# Altium project TPcape_breakout.PrjPcb
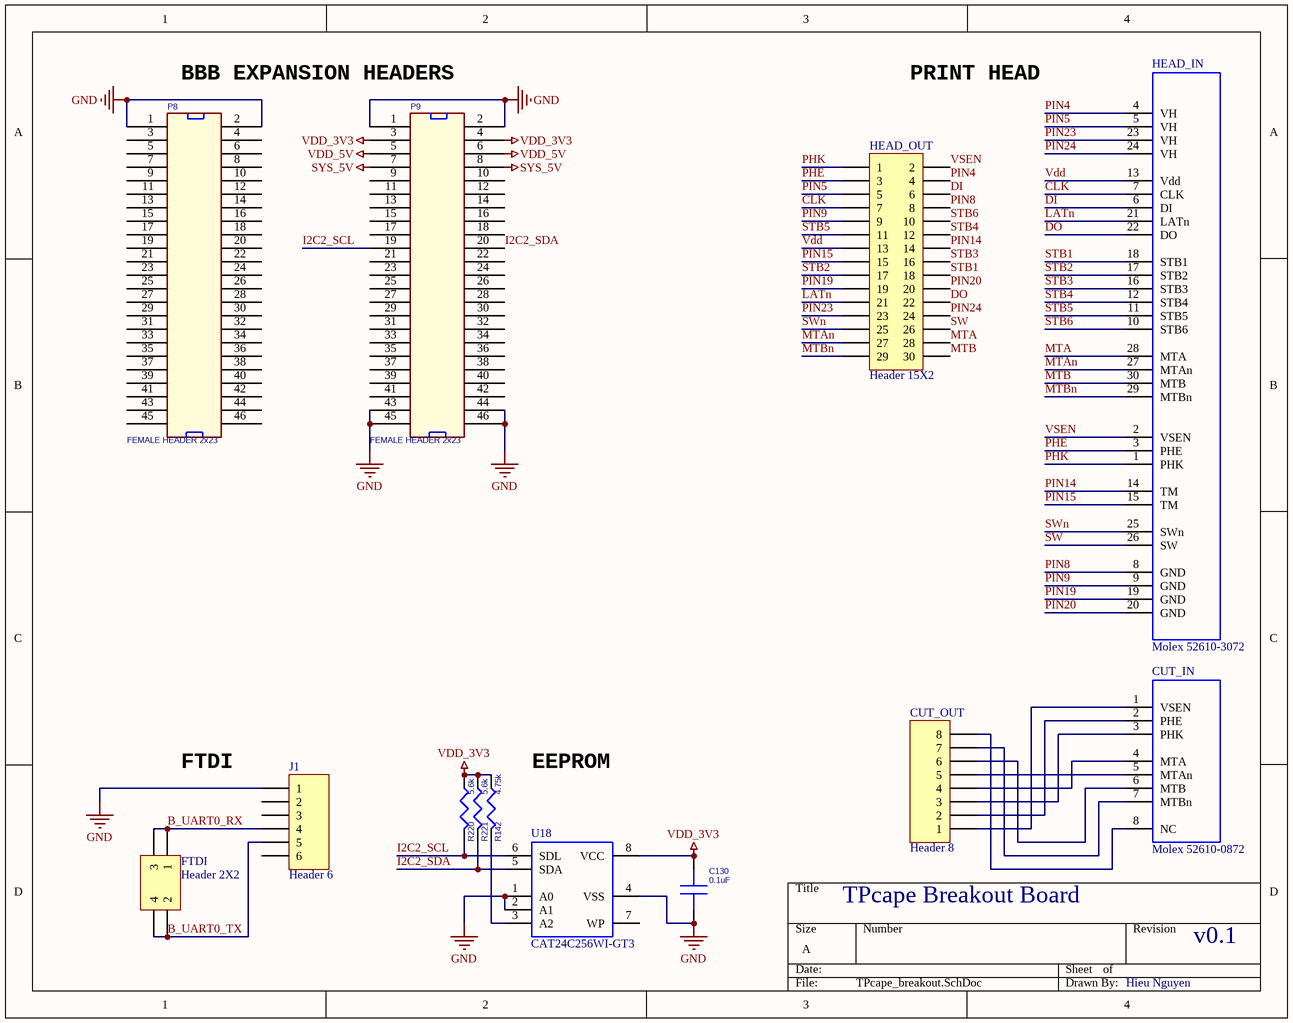
[diagram p0: TPcape_breakout.SchDoc]
1 sheet, 13 parts. Net scope: global (net labels, ports and power ports of the same name join across sheets).
Board file: TPcape_breakout.PcbDoc

## Sheet TPcape_breakout.SchDoc
size A

### Parts
C130  0.1uF  [402]
CUT_IN  Molex 52610-0872  [Molex 52610-0872]
CUT_OUT  Header 8  [HDR1X8]
FTDI  Header 2X2  [SSM-102-S-DV]
HEAD_IN  Molex 52610-3072  [Molex 52610-3072]
HEAD_OUT  Header 15X2  [HDR2X15]
J1  Header 6  [HDR1X6]
P8  FEMALE HEADER 2x23  [HDR2X23]
P9  FEMALE HEADER 2x23  [HDR2X23]
R142  4.75k  [402]
R220  5.6k  [402]
R221  5.6k  [402]
U18  CAT24C256WI-GT3  [CAT24C256WI-GT3]

### Nets
GND: C130.2 J1.1 P8.1 P8.2 P9.1 P9.2 P9.43 P9.44 P9.45 P9.46 U18.1(A0) U18.2(A1) U18.4(VSS)
SYS_5V: P9.7 P9.8
VDD_3V3: C130.1 P9.3 P9.4 R142.2(P2) R220.2(P2) R221.2(P2) U18.8(VCC)
VDD_5V: P9.5 P9.6
B_UART0_RX: FTDI.1 FTDI.3 J1.4
B_UART0_TX: FTDI.2 FTDI.4 J1.5
CLK: HEAD_IN.7(CLK) HEAD_OUT.7
DI: HEAD_IN.6(DI) HEAD_OUT.6
DO: HEAD_IN.22(DO) HEAD_OUT.22
I2C2_SCL: P9.19 R220.1(P1) U18.6(SDL)
I2C2_SDA: P9.20 R221.1(P1) U18.5(SDA)
LATn: HEAD_IN.21(LATn) HEAD_OUT.21
MTA: HEAD_IN.28(MTA) HEAD_OUT.28
MTAn: HEAD_IN.27(MTAn) HEAD_OUT.27
MTB: HEAD_IN.30(MTB) HEAD_OUT.30
MTBn: HEAD_IN.29(MTBn) HEAD_OUT.29
PHE: HEAD_IN.3(PHE) HEAD_OUT.3
PHK: HEAD_IN.1(PHK) HEAD_OUT.1
PIN4: HEAD_IN.4(VH) HEAD_OUT.4
PIN5: HEAD_IN.5(VH) HEAD_OUT.5
PIN8: HEAD_IN.8(GND) HEAD_OUT.8
PIN9: HEAD_IN.9(GND) HEAD_OUT.9
PIN14: HEAD_IN.14(TM) HEAD_OUT.14
PIN15: HEAD_IN.15(TM) HEAD_OUT.15
PIN19: HEAD_IN.19(GND) HEAD_OUT.19
PIN20: HEAD_IN.20(GND) HEAD_OUT.20
PIN23: HEAD_IN.23(VH) HEAD_OUT.23
PIN24: HEAD_IN.24(VH) HEAD_OUT.24
STB1: HEAD_IN.18(STB1) HEAD_OUT.18
STB2: HEAD_IN.17(STB2) HEAD_OUT.17
STB3: HEAD_IN.16(STB3) HEAD_OUT.16
STB4: HEAD_IN.12(STB4) HEAD_OUT.12
STB5: HEAD_IN.11(STB5) HEAD_OUT.11
STB6: HEAD_IN.10(STB6) HEAD_OUT.10
SW: HEAD_IN.26(SW) HEAD_OUT.26
SWn: HEAD_IN.25(SWn) HEAD_OUT.25
Vdd: HEAD_IN.13(Vdd) HEAD_OUT.13
VSEN: HEAD_IN.2(VSEN) HEAD_OUT.2
NetCUT_IN_1: CUT_IN.1(VSEN) CUT_OUT.1
NetCUT_IN_2: CUT_IN.2(PHE) CUT_OUT.2
NetCUT_IN_3: CUT_IN.3(PHK) CUT_OUT.3
NetCUT_IN_4: CUT_IN.4(MTA) CUT_OUT.4
NetCUT_IN_5: CUT_IN.5(MTAn) CUT_OUT.5
NetCUT_IN_6: CUT_IN.6(MTB) CUT_OUT.6
NetCUT_IN_7: CUT_IN.7(MTBn) CUT_OUT.7
NetCUT_IN_8: CUT_IN.8(NC) CUT_OUT.8
NetR142_1: R142.1(P1) U18.3(A2)

Not connected (* = marked no-connect by the designer): J1 2 3 6; P8 3(2) 4(27) 5(3) 6(28) 7(4) 8(29) 9(5) 10(30) 11(6) 12(31) 13(7) 14(32) 15(8) 16(33) 17(9) 18(34) 19(10) 20(35) 21(11) 22(36) 23(12) 24(37) 25(13) 26(38) 27(14) 28(39) 29(15) 30(40) 31(16) 32(41) 33(17) 34(42) 35(18) 36(43) 37(19) 38(44) 39(20) 40(45) 41(21) 42(46) 43(22) 44(47) 45(23) 46(48); P9 9(5) 10(30) 11(6) 12(31) 13(7) 14(32) 15(8) 16(33) 17(9) 18(34) 21(11) 22(36) 23(12) 24(37) 25(13) 26(38) 27(14) 28(39) 29(15) 30(40) 31(16) 32(41) 33(17) 34(42) 35(18) 36(43) 37(19) 38(44) 39(20) 40(45) 41(21) 42(46); U18 7(WP)

### Notes on the sheet
- BBB EXPANSION HEADERS
- PRINT HEAD
- FTDI
- EEPROM
- TPcape Breakout Board
- v0.1
- Hieu Nguyen

### Library data of the parts
C130 = CAP SMD: No Description
CUT_IN = Molex 52610-0872: FPC connector for Fujitsu FTP-628MCL401 (Molex 52610-0871 is obsolete)
CUT_OUT = Header 8: Header, 8-Pin; LatestRevisionDate: 17-Jul-2002; LatestRevisionNote: Re-released for DXP Platform.; Publisher: Altium Limited
FTDI = Header 2X2: Header, 2-Pin, Dual row; LatestRevisionDate: 17-Jul-2002; LatestRevisionNote: Re-released for DXP Platform.; Publisher: Altium Limited
HEAD_IN = Molex 52610-3072: FPC connector for Fujitsu FTP-628MCL401 print head (Molex 52610-3071 is obsolete)
HEAD_OUT = Header 15X2: Header, 15-Pin, Dual row; LatestRevisionDate: 17-Jul-2002; LatestRevisionNote: Re-released for DXP Platform.; Publisher: Altium Limited
J1 = Header 6: Header, 6-Pin; LatestRevisionDate: 17-Jul-2002; LatestRevisionNote: Re-released for DXP Platform.; Publisher: Altium Limited
P8 P9 = HDR_46_F_2_0.1_0.1: CONN HEADER FMAL 46PS.1" DL GOLD; Manufacturer: Sullins Connector Solutions; Manufacturer Part Number: PPPC232LFBN-RC; Number of Positions: 46; Number of Positions Loaded: All; Pitch: 0.100" (2.54mm); Supplier 1: Digi-Key; Supplier Part Number 1: S7126-ND; RoHS: RoHS Compliant; Category: Connectors, Interconnects; Stock 1: 750; Pricing 1: 1=2.75, 10=2.325, 25=2.2196, 50=2.0084, 100=1.7969, 250=1.58552, 500=1.4798, 1000=1.3741, 2500=1.32125 (USD); Connector Type: Header; Contact Type: Female Socket; Number of Rows: 2; Row Spacing: 0.100" (2.54mm); Mounting Type: Through Hole; Termination: Solder; Fastening Type: -; Features: -; Contact Finish: Gold; Contact Finish Thickness: Flash; Color: Black; Packaging: Bulk; ComponentLink1URL: http://www.sullinscorp.com/drawings/78_P(N)PxCxxxLFBN-RC,_10492-G.pdf; ComponentLink1Description: http://www.sullinscorp.com/drawings/78_P(N)PxCxxxLFBN-RC,_10492-G.pdf
R142 R220 R221 = RES SMD: RES 5.6K OHM 1/16W 5% 0402 SMD; Manufacturer: Rohm Semiconductor; Manufacturer Part Number: MCR01MZPJ103; Power (Watts): 0.063W, 1/16W; Temperature Coefficient: ±200ppm/°C; Supplier 1: Digi-Key; Supplier Part Number 1: RHM10KJDKR-ND; RoHS: RoHS Compliant; Category: Resistors; Stock 1: 452072; Pricing 1: 1=0.1, 10=0.019, 25=0.014, 100=0.0078, 250=0.00596, 500=0.00476, 1000=0.0035, 5000=0.00251 (USD); Composition: Thick Film; Features: Automotive AEC-Q200 Qualified; Tolerance: ±5%; Package / Case: 0402 (1005 Metric); Supplier Device Package: 0402 (1005 Metric); Size / Dimension: 0.039" L x 0.020" W (1.00mm x 0.50mm); Height: 0.016" (0.40mm); Number of Terminations: 2; Packaging: Digi-Reel®; ComponentLink1URL: http://rohmfs.rohm.com/en/products/databook/datasheet/passive/resistor/chip_resistor/mcr_a.pdf; ComponentLink1Description: http://rohmfs.rohm.com/en/products/databook/datasheet/passive/resistor/chip_resistor/mcr_a.pdf
  R142: Resistance (Ohms): 4.75k
  R220 R221: Resistance (Ohms): 5.6k
U18 = CAT24C256WI-GT3: IC EEPROM 256KBIT 400KHZ 8SOIC